# Altium schematic sheet Laser_module.schdoc: Laser Module
size 420 x 297 mm; EDA_Number: ARTIQ; Projet: KASLI 3U subsystem; CheckedBy: MK; Author: G.K.; CompanyName: CREOTECH; DrawnBy: G.K.; Organization: CTI SA; Address1: Creotech Instruments SA; Address2: Okulickiego 7/9, 05-500 Poland; DocumentNumber: 1; Revision: -; SheetNumber: 1; SheetTotal: 5; ModifiedBy: -; CreateDate: XX/XX/XXXX; CheckedDate: -; Title2: Top; DivGrp: CTI; Designer: G.K.; ModifiedDate: -; ProjectName: FMC DAC 100M 14B 16CHA ADC 2M 14B 4CHA
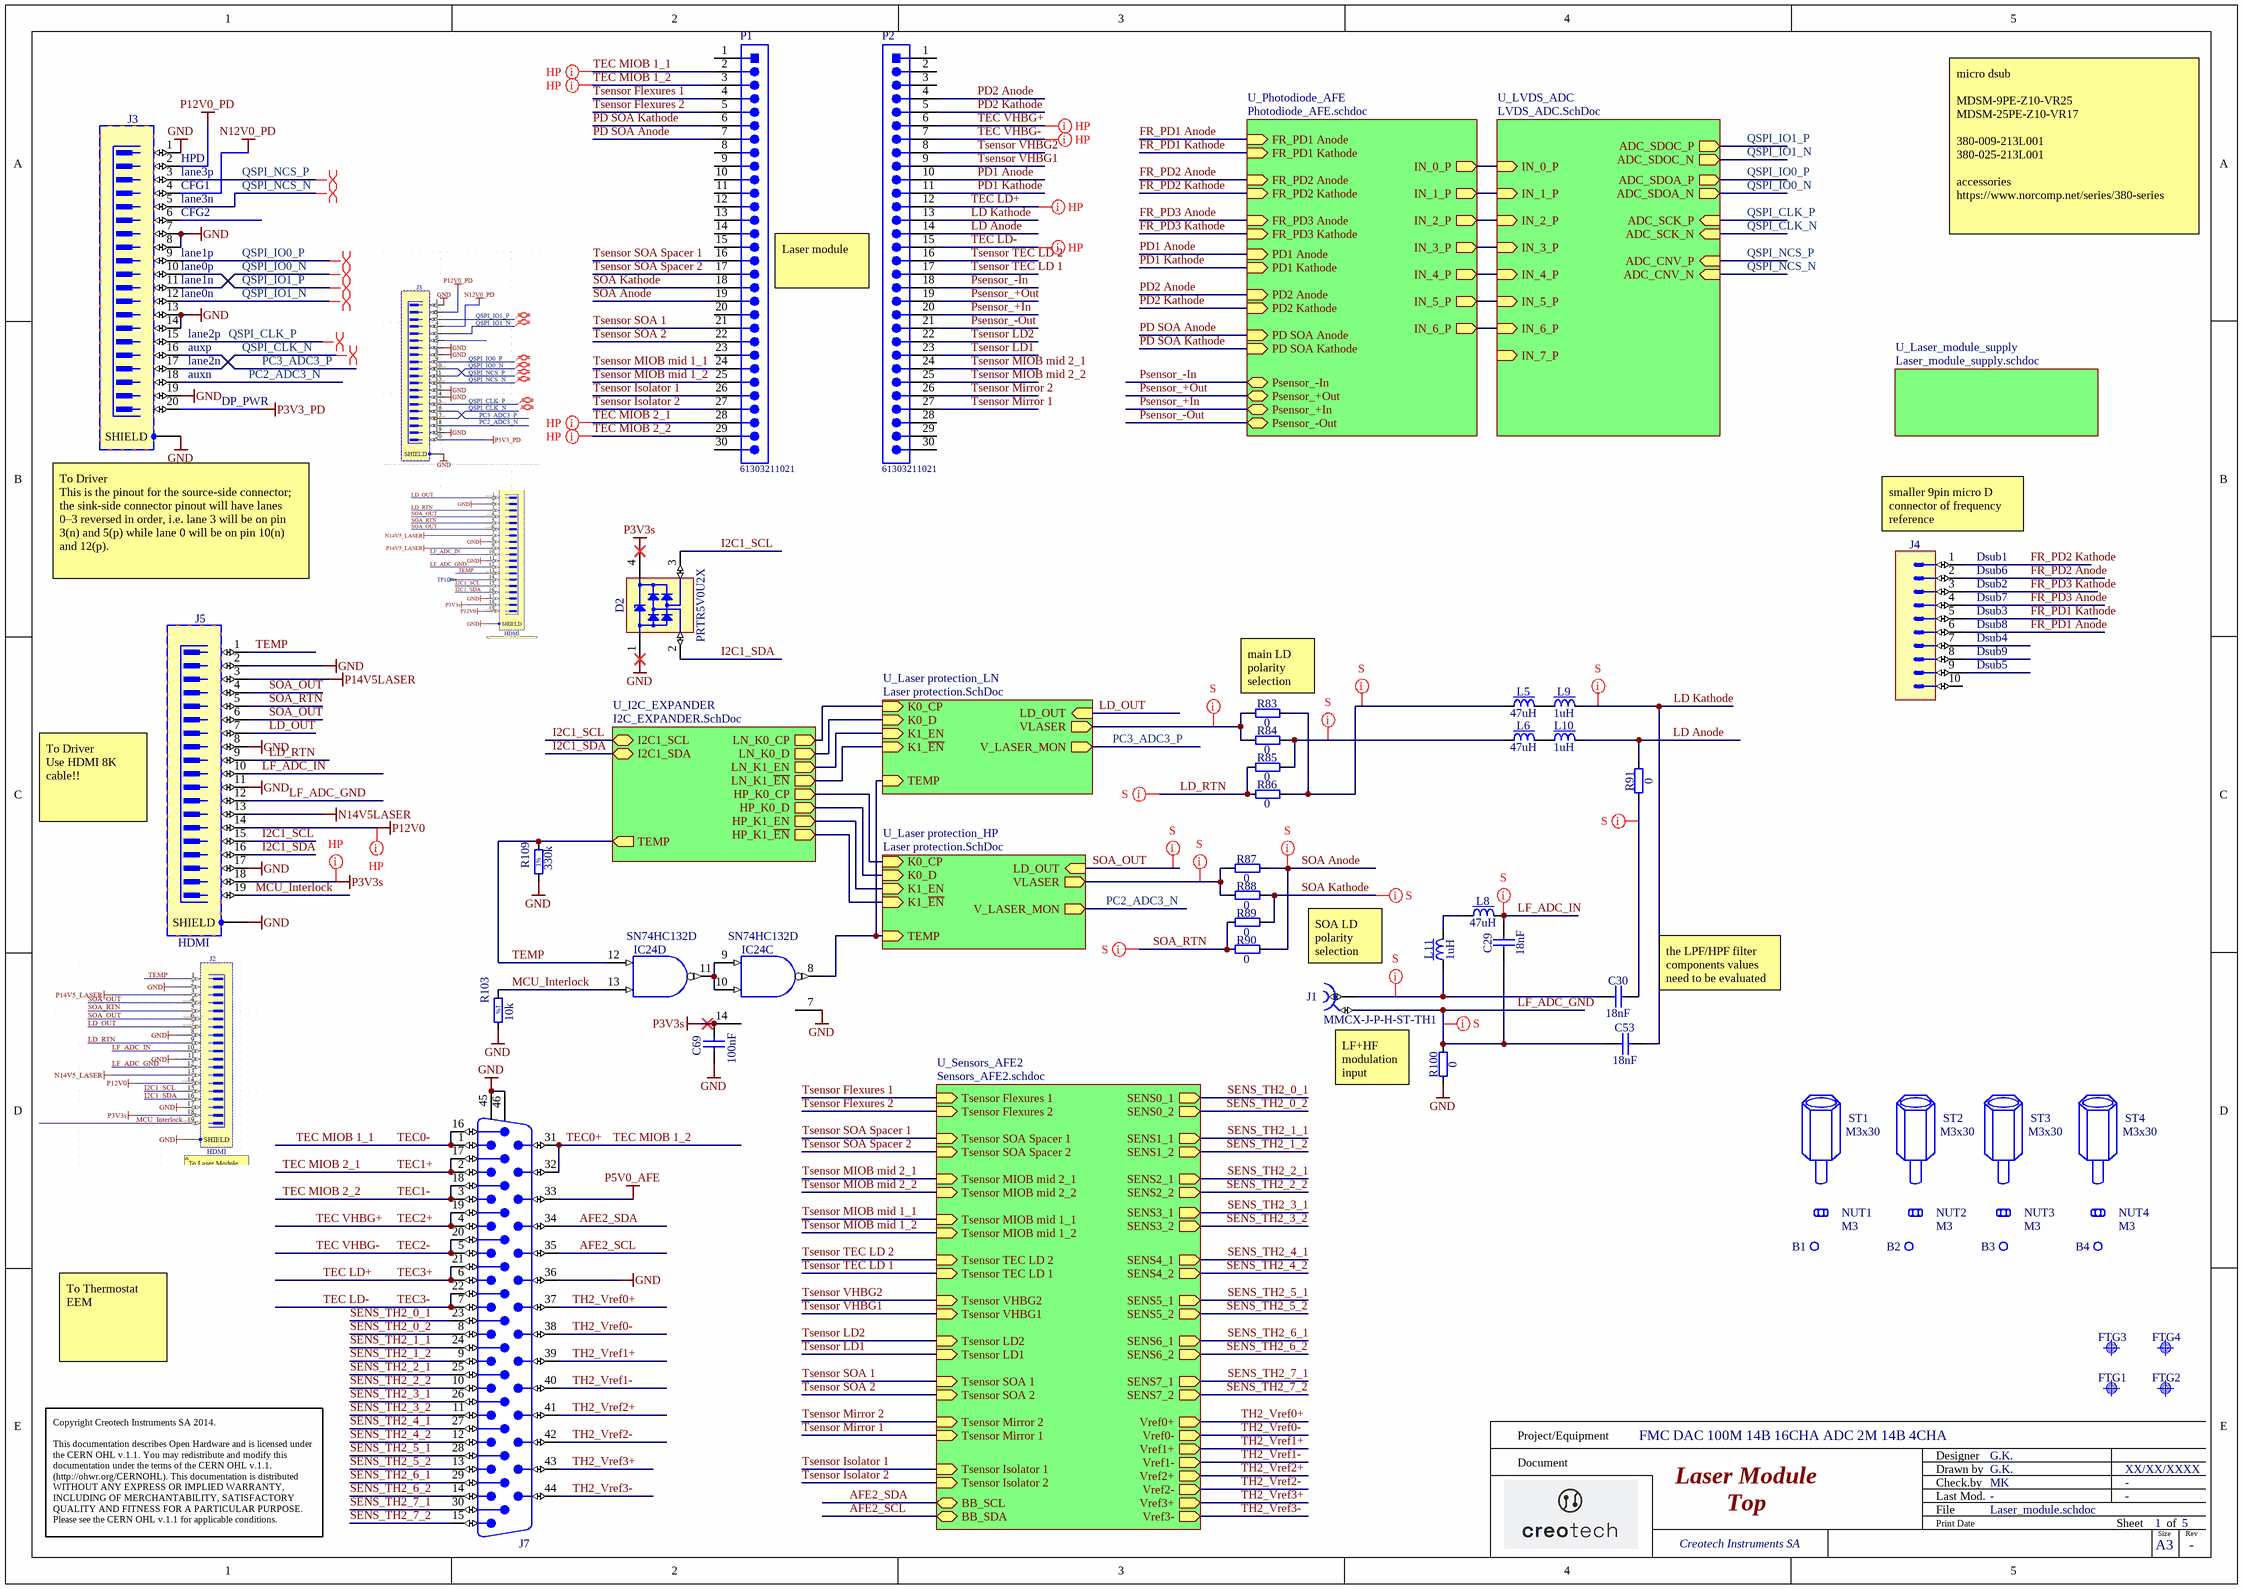
[diagram p0: Laser_module.schdoc]

## Parts
B1  Plated Hole  [MTG320_550]  (value not drawn)  (no BOM)
B2  Plated Hole  [MTG320_550]  (value not drawn)  (no BOM)
B3  Plated Hole  [MTG320_550]  (value not drawn)  (no BOM)
B4  Plated Hole  [MTG320_550]  (value not drawn)  (no BOM)
C29  18nF  [CAPC3216X140N]
C30  18nF  [CAPC3216X140N]
C53  18nF  [CAPC3216X140N]
C69  100nF  [CAPC1608X87N]
D2  PRTR5V0U2X  [SOT190P230X110-4N]
FTG1  Use only in PCB  [FIDUCIAL_TOP_C100-200]  (value not drawn)
FTG2  Use only in PCB  [FIDUCIAL_TOP_S100-200]  (value not drawn)
FTG3  Use only in PCB  [FIDUCIAL_TOP_C100-200]  (value not drawn)
FTG4  Use only in PCB  [FIDUCIAL_TOP_S100-200]  (value not drawn)
IC24  SN74HC132D  [SOIC127P600X175-14N]  (parts C,D of 4)
J1  Manufacturer Part Number: MMCX-J-P-H-ST-TH1  [SAMTEC_MMCX-J-P-H-ST-TH1]  (hidden comment: Coax_1Female_1Shield)
J3  Thunderbolt  [JAE_DP3AR020SU32JQ1R400]  (value not drawn)
J4  Header 10  [3M_N2510-6002RB]  (value not drawn)
J5  HDMI  [MOLEX_47151-0001]
J7  D-Sub  [AMPHENOL_10090926-P444XLF]  (value not drawn)
L5  47uH  [IND_MURATA-PS_8400]
L6  47uH  [IND_MURATA-PS_8400]
L8  47uH  [IND_MURATA_LQH32C]
L9  1uH  [INDC2014X145N]
L10  1uH  [INDC2014X145N]
L11  1uH  [INDC2014X145N]
NUT1  M3  [BOSSARD_BN628-1241443_v]
NUT2  M3  [BOSSARD_BN628-1241443_v]
NUT3  M3  [BOSSARD_BN628-1241443_v]
NUT4  M3  [BOSSARD_BN628-1241443_v]
P1  61303211021  [61303211021_30]
P2  61303211021  [61303211021_30]
R83  0  [RESC2012X60N]
R84  0  [RESC2012X60N]
R85  0  [RESC2012X60N]
R86  0  [RESC2012X60N]
R87  0  [RESC2012X60N]
R88  0  [RESC2012X60N]
R89  0  [RESC2012X60N]
R90  0  [RESC2012X60N]
R91  0  [RESC1005X40N]
R100  0  [RESC1005X40N]
R103  10k  [RESC1608X55N]
R109  330k  [RESC1608X55N]
ST1  M3x30  [DREMEC_TFM-M3X30/DR213]
ST2  M3x30  [DREMEC_TFM-M3X30/DR213]
ST3  M3x30  [DREMEC_TFM-M3X30/DR213]
ST4  M3x30  [DREMEC_TFM-M3X30/DR213]

## Sub-sheets
U_I2C_EXPANDER = I2C_EXPANDER.SchDoc: LN_K0_CP (out), LN_K0_D (out), LN_K1_EN (out), LN_K1_~{EN} (out), HP_K0_CP (out), HP_K0_D (out), HP_K1_EN (out), TEMP (out), I2C1_SCL (bidir), I2C1_SDA (bidir), HP_K1_~{EN} (out)
U_Laser protection_HP = Laser protection.SchDoc: LD_OUT (in), V_LASER_MON (out), K1_~{EN} (in), K1_EN (in), K0_D (in), K0_CP (in), TEMP (in), VLASER (out)
U_Laser protection_LN = Laser protection.SchDoc: LD_OUT (in), V_LASER_MON (out), K1_~{EN} (in), K1_EN (in), K0_D (in), K0_CP (in), TEMP (in), VLASER (out)
U_Laser_module_supply = Laser_module_supply.schdoc: no entries
U_LVDS_ADC = LVDS_ADC.SchDoc: IN_7_P (in), IN_6_P (in), IN_2_P (in), IN_4_P (in), IN_1_P (in), IN_3_P (in), IN_0_P (in), IN_5_P (in), ADC_CNV_N (in), ADC_SCK_P (in), ADC_SDOA_N (out), ADC_SDOC_P (out), ADC_SDOC_N (out), ADC_SDOA_P (out), ADC_SCK_N (in), ADC_CNV_P (in)
U_Photodiode_AFE = Photodiode_AFE.schdoc: FR_PD1 Anode (in), FR_PD1 Kathode (in), FR_PD2 Anode (in), FR_PD2 Kathode (in), FR_PD3 Anode (in), FR_PD3 Kathode (in), PD1 Anode (in), PD1 Kathode (in), PD2 Anode (in), PD2 Kathode (in), PD SOA Anode (in), PD SOA Kathode (in), Psensor_-In (bidir), Psensor_+Out (bidir), Psensor_+In (bidir), Psensor_-Out (bidir), IN_0_P (out), IN_1_P (out), IN_2_P (out), IN_3_P (out), IN_4_P (out), IN_5_P (out), IN_6_P (out)
U_Sensors_AFE2 = Sensors_AFE2.schdoc: SENS0_1 (out), SENS0_2 (out), SENS1_1 (out), SENS1_2 (out), SENS2_1 (out), SENS2_2 (out), SENS3_1 (out), SENS3_2 (out), SENS4_1 (out), SENS4_2 (out), SENS5_1 (out), SENS5_2 (out), SENS6_1 (out), SENS6_2 (out), SENS7_1 (out), SENS7_2 (out), Vref0+ (out), Vref0- (out), Vref1+ (out), Vref1- (out), Vref2+ (out), Vref2- (out), Vref3+ (out), Vref3- (out), BB_SCL (bidir), BB_SDA (bidir), Tsensor MIOB mid 2_1 (in), Tsensor MIOB mid 2_2 (in), Tsensor TEC LD 2 (in), Tsensor TEC LD 1 (in), Tsensor LD2 (in), Tsensor LD1 (in), Tsensor SOA 1 (in), Tsensor SOA 2 (in), Tsensor Mirror 2 (in), Tsensor Flexures 1 (in), Tsensor Flexures 2 (in), Tsensor SOA Spacer 1 (in), Tsensor SOA Spacer 2 (in), Tsensor MIOB mid 1_1 (in), Tsensor VHBG2 (in), Tsensor MIOB mid 1_2 (in), Tsensor VHBG1 (in), Tsensor Mirror 1 (in), Tsensor Isolator 1 (in), Tsensor Isolator 2 (in)

## Nets
GND: C69.1 D2.1(GND) IC24.7(GND) J3.1 J3.7 J3.8 J3.13 J3.14 J3.19 J3.SHIELD J5.2 J5.8 J5.11 J5.17 J5.SHIELD J7.36 J7.45 J7.46 R100.1 R103.2 R109.1
N12V0_PD: J3.4
N14V5LASER: J5.13
P3V3_PD: J3.20
P3V3s: C69.2 D2.4(VCC) IC24.14(VCC) J5.18  [also labelled VCC]
P5V0_AFE: J7.33
P12V0: J5.14
P12V0_PD: J3.2
P14V5LASER: J5.3
AFE2_SCL: J7.35 ; sheet U_Sensors_AFE2/BB_SDA
AFE2_SDA: J7.34 ; sheet U_Sensors_AFE2/BB_SCL
FR_PD1 Anode: J4.6 ; sheet U_Photodiode_AFE/FR_PD1 Anode
FR_PD1 Kathode: J4.5 ; sheet U_Photodiode_AFE/FR_PD1 Kathode
FR_PD2 Anode: J4.2 ; sheet U_Photodiode_AFE/FR_PD2 Anode
FR_PD2 Kathode: J4.1 ; sheet U_Photodiode_AFE/FR_PD2 Kathode
FR_PD3 Anode: J4.4 ; sheet U_Photodiode_AFE/FR_PD3 Anode
FR_PD3 Kathode: J4.3 ; sheet U_Photodiode_AFE/FR_PD3 Kathode
I2C1_SCL: D2.3(I/O2) J5.15 ; sheet U_I2C_EXPANDER/I2C1_SCL
I2C1_SDA: D2.2(I/O1) J5.16 ; sheet U_I2C_EXPANDER/I2C1_SDA
LD Anode: L10.2 P2.14 R91.2
LD Kathode: C53.2 L9.2 P2.13
LD_OUT: J5.7 ; sheet U_Laser protection_LN/LD_OUT
LD_RTN: J5.9 R85.1 R86.1
LF_ADC_GND: C29.1 C53.1 J1.2 J5.12 R100.2
LF_ADC_IN: C29.2 J5.10 L8.2
MCU_Interlock: IC24.13(B) J5.19 R103.1
PC2_ADC3_N: J3.18 ; sheet U_Laser protection_HP/V_LASER_MON
PC3_ADC3_P: J3.16 ; sheet U_Laser protection_LN/V_LASER_MON
PD1 Anode: P2.10 ; sheet U_Photodiode_AFE/PD1 Anode
PD1 Kathode: P2.11 ; sheet U_Photodiode_AFE/PD1 Kathode
PD2 Anode: P2.4 ; sheet U_Photodiode_AFE/PD2 Anode
PD2 Kathode: P2.5 ; sheet U_Photodiode_AFE/PD2 Kathode
PD SOA Anode: P1.7 ; sheet U_Photodiode_AFE/PD SOA Anode
PD SOA Kathode: P1.6 ; sheet U_Photodiode_AFE/PD SOA Kathode
Psensor_+In: P2.20 ; sheet U_Photodiode_AFE/Psensor_+In
Psensor_+Out: P2.19 ; sheet U_Photodiode_AFE/Psensor_+Out
Psensor_-In: P2.18 ; sheet U_Photodiode_AFE/Psensor_-In
Psensor_-Out: P2.21 ; sheet U_Photodiode_AFE/Psensor_-Out
QSPI_CLK_N: J3.17 ; sheet U_LVDS_ADC/ADC_SCK_N
QSPI_CLK_P: J3.15 ; sheet U_LVDS_ADC/ADC_SCK_P
QSPI_IO0_N: J3.11 ; sheet U_LVDS_ADC/ADC_SDOA_N
QSPI_IO0_P: J3.9 ; sheet U_LVDS_ADC/ADC_SDOA_P
QSPI_IO1_N: J3.12 ; sheet U_LVDS_ADC/ADC_SDOC_N
QSPI_IO1_P: J3.10 ; sheet U_LVDS_ADC/ADC_SDOC_P
QSPI_NCS_N: J3.5 ; sheet U_LVDS_ADC/ADC_CNV_N
QSPI_NCS_P: J3.3 ; sheet U_LVDS_ADC/ADC_CNV_P
SENS_TH2_0_1: J7.23 ; sheet U_Sensors_AFE2/SENS0_1
SENS_TH2_0_2: J7.8 ; sheet U_Sensors_AFE2/SENS0_2
SENS_TH2_1_1: J7.24 ; sheet U_Sensors_AFE2/SENS1_1
SENS_TH2_1_2: J7.9 ; sheet U_Sensors_AFE2/SENS1_2
SENS_TH2_2_1: J7.25 ; sheet U_Sensors_AFE2/SENS2_1
SENS_TH2_2_2: J7.10 ; sheet U_Sensors_AFE2/SENS2_2
SENS_TH2_3_1: J7.26 ; sheet U_Sensors_AFE2/SENS3_1
SENS_TH2_3_2: J7.11 ; sheet U_Sensors_AFE2/SENS3_2
SENS_TH2_4_1: J7.27 ; sheet U_Sensors_AFE2/SENS4_1
SENS_TH2_4_2: J7.12 ; sheet U_Sensors_AFE2/SENS4_2
SENS_TH2_5_1: J7.28 ; sheet U_Sensors_AFE2/SENS5_1
SENS_TH2_5_2: J7.13 ; sheet U_Sensors_AFE2/SENS5_2
SENS_TH2_6_1: J7.29 ; sheet U_Sensors_AFE2/SENS6_1
SENS_TH2_6_2: J7.14 ; sheet U_Sensors_AFE2/SENS6_2
SENS_TH2_7_1: J7.30 ; sheet U_Sensors_AFE2/SENS7_1
SENS_TH2_7_2: J7.15 ; sheet U_Sensors_AFE2/SENS7_2
SOA Anode: P1.19 R87.2 R90.2
SOA Kathode: P1.18 R88.2 R89.2
SOA_OUT: J5.4 J5.6 ; sheet U_Laser protection_HP/LD_OUT
SOA_RTN: J5.5 R89.1 R90.1
TEC LD+: J7.6 J7.21 P2.12  [also labelled TEC3+]
TEC LD-: J7.7 J7.22 P2.15  [also labelled TEC3-]
TEC MIOB 1_1: J7.1 J7.16 P1.2  [also labelled TEC0-]
TEC MIOB 1_2: J7.31 J7.32 P1.3  [also labelled TEC0+]
TEC MIOB 2_1: J7.2 J7.17 P1.28  [also labelled TEC1+]
TEC MIOB 2_2: J7.3 J7.18 P1.29  [also labelled TEC1-]
TEC VHBG+: J7.4 J7.19 P2.6  [also labelled TEC2+]
TEC VHBG-: J7.5 J7.20 P2.7  [also labelled TEC2-]
TEMP: IC24.12(A) J5.1 R109.2 ; sheet U_I2C_EXPANDER/TEMP
TH2_Vref0+: J7.37 ; sheet U_Sensors_AFE2/Vref0+
TH2_Vref0-: J7.38 ; sheet U_Sensors_AFE2/Vref0-
TH2_Vref1+: J7.39 ; sheet U_Sensors_AFE2/Vref1+
TH2_Vref1-: J7.40 ; sheet U_Sensors_AFE2/Vref1-
TH2_Vref2+: J7.41 ; sheet U_Sensors_AFE2/Vref2+
TH2_Vref2-: J7.42 ; sheet U_Sensors_AFE2/Vref2-
TH2_Vref3+: J7.43 ; sheet U_Sensors_AFE2/Vref3+
TH2_Vref3-: J7.44 ; sheet U_Sensors_AFE2/Vref3-
Tsensor Flexures 1: P1.4 ; sheet U_Sensors_AFE2/Tsensor Flexures 1
Tsensor Flexures 2: P1.5 ; sheet U_Sensors_AFE2/Tsensor Flexures 2
Tsensor Isolator 1: P1.26 ; sheet U_Sensors_AFE2/Tsensor Isolator 1
Tsensor Isolator 2: P1.27 ; sheet U_Sensors_AFE2/Tsensor Isolator 2
Tsensor LD1: P2.23 ; sheet U_Sensors_AFE2/Tsensor LD1
Tsensor LD2: P2.22 ; sheet U_Sensors_AFE2/Tsensor LD2
Tsensor MIOB mid 1_1: P1.24 ; sheet U_Sensors_AFE2/Tsensor MIOB mid 1_1
Tsensor MIOB mid 1_2: P1.25 ; sheet U_Sensors_AFE2/Tsensor MIOB mid 1_2
Tsensor MIOB mid 2_1: P2.24 ; sheet U_Sensors_AFE2/Tsensor MIOB mid 2_1
Tsensor MIOB mid 2_2: P2.25 ; sheet U_Sensors_AFE2/Tsensor MIOB mid 2_2
Tsensor Mirror 1: P2.27 ; sheet U_Sensors_AFE2/Tsensor Mirror 1
Tsensor Mirror 2: P2.26 ; sheet U_Sensors_AFE2/Tsensor Mirror 2
Tsensor SOA 1: P1.21 ; sheet U_Sensors_AFE2/Tsensor SOA 1
Tsensor SOA 2: P1.22 ; sheet U_Sensors_AFE2/Tsensor SOA 2
Tsensor SOA Spacer 1: P1.16 ; sheet U_Sensors_AFE2/Tsensor SOA Spacer 1
Tsensor SOA Spacer 2: P1.17 ; sheet U_Sensors_AFE2/Tsensor SOA Spacer 2
Tsensor TEC LD 1: P2.17 ; sheet U_Sensors_AFE2/Tsensor TEC LD 1
Tsensor TEC LD 2: P2.16 ; sheet U_Sensors_AFE2/Tsensor TEC LD 2
Tsensor VHBG1: P2.9 ; sheet U_Sensors_AFE2/Tsensor VHBG1
Tsensor VHBG2: P2.8 ; sheet U_Sensors_AFE2/Tsensor VHBG2
NetC30_1: C30.1 J1.1 L11.1
NetC30_2: C30.2 R91.1
NetIC24_8: IC24.8(~{O}) ; sheet U_Laser protection_LN/TEMP, sheet U_Laser protection_HP/TEMP
NetIC24_9: IC24.9(A) IC24.10(B) IC24.11(~{O})
NetL5_1: L5.1 R83.2 R86.2
NetL5_2: L5.2 L9.1
NetL6_1: L6.1 R84.2 R85.2
NetL6_2: L6.2 L10.1
NetL8_1: L8.1 L11.2
NetR83_1: R83.1 R84.1 ; sheet U_Laser protection_LN/VLASER
NetR87_1: R87.1 R88.1 ; sheet U_Laser protection_HP/VLASER
(unnamed): sheet U_Photodiode_AFE/IN_0_P, sheet U_LVDS_ADC/IN_0_P
(unnamed): sheet U_Photodiode_AFE/IN_1_P, sheet U_LVDS_ADC/IN_1_P
(unnamed): sheet U_Photodiode_AFE/IN_2_P, sheet U_LVDS_ADC/IN_2_P
(unnamed): sheet U_Photodiode_AFE/IN_3_P, sheet U_LVDS_ADC/IN_3_P
(unnamed): sheet U_Photodiode_AFE/IN_4_P, sheet U_LVDS_ADC/IN_4_P
(unnamed): sheet U_Photodiode_AFE/IN_5_P, sheet U_LVDS_ADC/IN_5_P
(unnamed): sheet U_Photodiode_AFE/IN_6_P, sheet U_LVDS_ADC/IN_6_P
(unnamed): sheet U_I2C_EXPANDER/LN_K0_CP, sheet U_Laser protection_LN/K0_CP
(unnamed): sheet U_I2C_EXPANDER/LN_K0_D, sheet U_Laser protection_LN/K0_D
(unnamed): sheet U_I2C_EXPANDER/LN_K1_EN, sheet U_Laser protection_LN/K1_EN
(unnamed): sheet U_I2C_EXPANDER/LN_K1_~{EN}, sheet U_Laser protection_LN/K1_~{EN}
(unnamed): sheet U_I2C_EXPANDER/HP_K0_CP, sheet U_Laser protection_HP/K0_CP
(unnamed): sheet U_I2C_EXPANDER/HP_K0_D, sheet U_Laser protection_HP/K0_D
(unnamed): sheet U_I2C_EXPANDER/HP_K1_EN, sheet U_Laser protection_HP/K1_EN
(unnamed): sheet U_I2C_EXPANDER/HP_K1_~{EN}, sheet U_Laser protection_HP/K1_~{EN}

Not connected (* = marked no-connect by the designer): B1 1; B2 1; B3 1; B4 1; J3 6; J4 7 8 9 10; P1 1 8 9 10 11 12 13 14 15 20 23 30; P2 1 2 3 28 29 30

## Layout directives
differential pair: QSPI_CLK_N, QSPI_CLK_P, QSPI_IO0_N, QSPI_IO0_P, QSPI_IO1_N, QSPI_IO1_P, QSPI_NCS_N, QSPI_NCS_P
net class HP: P3V3s, P12V0, TEC LD+, TEC LD-, TEC MIOB 1_1, TEC MIOB 1_2, TEC MIOB 2_1, TEC MIOB 2_2, TEC VHBG+, TEC VHBG-
net class Sensitive: LD Kathode, LD_RTN, LF_ADC_GND, LF_ADC_IN, NetC30_1, NetC30_2, NetL5_1, NetL6_1, NetR83_1, NetR87_1, SOA Anode, SOA Kathode, SOA_OUT, SOA_RTN

## Notes on the sheet
- (near J3) CFG1
- (near J3) HPD
- (near J3) lane3p
- (near J3) lane1p
- (near J3) CFG2
- (near J3) lane3n
- micro dsub
  MDSM-9PE-Z10-VR25
  MDSM-25PE-Z10-VR17
  380-009-213L001
  380-025-213L001
  accessories
  https://www.norcomp.net/series/380-series
- (near J3) lane1n
- (near J3) lane0p
- (near J3) lane0n
- Laser module
- (near J3) lane2p
- (near J3) lane2n
- (near J3) auxp
- (near J3) auxn
- DP_PWR
- (near J4) smaller 9pin micro D connector of frequency reference
- (near J3) To Driver
  This is the pinout for the source-side connector; the sink-side connector pinout will have lanes 0–3 reversed in order, i.e. lane 3 will be on pin 3(n) and 5(p) while lane 0 will be on pin 10(n) and 12(p).
- (near J4) Dsub1
- (near J4) Dsub2
- (near J4) Dsub6
- (near J4) Dsub3
- (near J4) Dsub4
- (near J4) Dsub5
- (near J4) Dsub7
- (near J4) Dsub8
- (near J4) Dsub9
- (near R83) main LD polarity selection
- To Driver
  Use HDMI 8K cable!!
- SOA LD polarity selection
- (near C30) the LPF/HPF filter components values need to be evaluated
- LF+HF modulation input
- To Thermostat EEM
- Project/Equipment
- Document
- Designer
- Drawn by
- Check.by
- Copyright Creotech Instruments SA 2014.
  This documentation describes Open Hardware and is licensed under the CERN OHL v.1.1. You may redistribute and modify this documentation under the terms of the CERN OHL v.1.1. (http://ohwr.org/CERNOHL). This documentation is distributed WITHOUT ANY EXPRESS OR IMPLIED WARRANTY, INCLUDING OF MERCHANTABILITY, SATISFACTORY QUALITY AND FITNESS FOR A PARTICULAR PURPOSE. Please see the CERN OHL v.1.1 for applicable conditions.
- File
- Last Mod.
- Print Date
- Sheet
- Size
- A3
- of
- Rev
- (in symbol R0603_10K_1%_0.1W_100PPM) 1%
- (in symbol R0603_330K_1%_0.1W_100PPM) 1%

## Library data of the parts
B1-B4 = PLATED_HOLE3.2_PAD5.5: Single Terminal Socket; Part Description: Plated Through Hole: Hole Dia.=3.2mm Pad Dia.=5.5mm; Mounted: No; Part Number: PLATED_HOLE3.2_PAD5.5; Component Type: Standard (No BOM); Pin Count: 1; Family: Plated Hole; Socket: No; SMD: No; Sense: No; Status: None; ComponentHeight: 0mm; HelpURL: Undefined; Author: CERN DEM JMW; CreateDate: 01.10.2012; LatestRevisionDate: 01.10.2012; PackageDescription: Plated Through Hole: Hole Dia.=3.2mm Pad Dia.=5.5mm
C29 C30 C53 = CC1206_18NF_50V_10%_X7R: Non-polarised capacitor; Part Description: SMD Multilayer Chip Ceramic Capacitor; Manufacturer: GENERIC; Manufacturer1 Part Number: 223858115639; Voltage: 50V; TC: X7R; Tolerance: ±10%; Part Number: CC1206_18NF_50V_10%_X7R; Component Kind: Standard; Component Type: Standard; Pin Count: 2; Value: 18nF; Status: Not Recommended; Manufacturer Part Number: CC1206_18NF_50V_10%_X7R; Case: 1206; Mounted: Yes; Socket: No; SMD: Yes; Sense: No; Manufacturer1 Example: PHYCOMP; Manufacturer1 ComponentHeight: 1.25mm; HelpURL: \\cern.ch\dfs\Applications\Altium\Datasheets\CC1206_X7R_PHYCOMP.pdf; Author: CERN DEM JLC; CreateDate: 03.12.2007; LatestRevisionDate: 03.12.2007
C69 = CC0603_100NF_50V_10%_X7R: Non-polarised capacitor; Part Description: SMD Multilayer Chip Ceramic Capacitor; Manufacturer: GENERIC; Manufacturer1 Part Number: 223858615649; Voltage: 50V; TC: X7R; Tolerance: ±10%; Part Number: CC0603_100NF_50V_10%_X7R; Component Kind: Standard; Component Type: Standard; Pin Count: 2; Value: 100nF; Status: Preferred; Manufacturer Part Number: CC0603_100NF_50V_10%_X7R; Case: 0603; Mounted: Yes; Socket: No; SMD: Yes; Sense: No; Manufacturer1 Example: PHYCOMP; Manufacturer1 ComponentHeight: 0.87mm; HelpURL: \\cern.ch\dfs\Applications\Altium\Datasheets\CC0603_X7R_PHYCOMP.pdf; Author: CERN DEM JLC; CreateDate: 03.12.2007; LatestRevisionDate: 03.12.2007
D2 = PRTR5V0U2X: Ultra Low Capacitance Double Rail-to-Rail ESD Protection Diode; Part Description: Ultra Low Capacitance (1pF) Double Rail-to-Rail ESD Protection Diode (8kV); Manufacturer: NXP SEMICONDUCTORS; Voltage: 5.5V; PressFit: No; Bonding: No; Part Number: PRTR5V0U2X; Component Kind: Standard; Component Type: Standard; Device: PRTR5V0U2X; PackageDescription: SOT143B, SOT, 1.90mm Pitch; 4 Pin, 1.30mm W X 2.90mm L X 1.10mm H body, IPC Medium Density; Manufacturer Part Number: PRTR5V0U2X; Pin Count: 4; Case: SOT143B; Mounted: Yes; Socket: No; SMD: Yes; Sense: No; ComponentHeight: 1.1mm; HelpURL: \\cern.ch\dfs\Applications\Altium\Datasheets\PRTR5V0U2X.pdf; Author: CERN DEM JLC; CreateDate: 22.03.2011; LatestRevisionDate: 22.03.2011
FTG1 FTG3 = FIDUCIAL_TARGET_C100-200: Fiducial Target; Part Description: Round Fiducial Target, Top Layer, 1.0mm, Top Solder 2.0mm, Keepout =2.0mm; Mounted: No; Part Number: FIDUCIAL_TARGET_C100-200; Component Kind: Standard (No BOM); Component Type: Standard (No BOM); Pin Count: 1; Family: Fiducial; Socket: No; SMD: Yes; Sense: No; Status: None; ComponentHeight: 0mm; HelpURL: Undefined; Author: CERN DEM JLC; CreateDate: 09.02.2010; LatestRevisionDate: 04.04.2012; PackageDescription: Round Fiducial Target, Top Layer, 1.0mm, Top Solder 2.0mm, Keepout =2.0mm
FTG2 FTG4 = FIDUCIAL_TARGET_S100-200: Fiducial Target; Part Description: Square Fiducial Target, Top Layer, 1.0mm, Top Solder 2.0mm, Keepout =2.0mm; Mounted: No; Part Number: FIDUCIAL_TARGET_S100-200; Component Kind: Standard (No BOM); Component Type: Standard (No BOM); Pin Count: 1; Family: Fiducial; Socket: No; SMD: Yes; Sense: No; Status: None; ComponentHeight: 0mm; HelpURL: Undefined; Author: CERN DEM JLC; CreateDate: 09.02.2010; LatestRevisionDate: 04.04.2012; PackageDescription: Square Fiducial Target, Top Layer, 1.0mm, Top Solder 2.0mm, Keepout =2.0mm
IC24 = SN74HC132D: Quad Positive NAND Gate With Schmitt-Trigger Input; Manufacturer: TEXAS INSTRUMENTS; PressFit: No; Bonding: No; Part Number: SN74HC132D; Component Kind: Standard; Component Type: Standard; Device: SN74HC132D; PackageDescription: SOIC 14, Pitch 1.27mm - Body 4x8.75mm, IPC Medium Density; Part Description: Quad Positive NAND Gate With Schmitt-Trigger Input; Manufacturer Part Number: SN74HC132D; Pin Count: 14; Case: SOIC14; Mounted: Yes; Socket: No; SMD: Yes; Sense: No; ComponentHeight: 1.75mm; Author: CERN DEM JLC; HelpURL: \\cern.ch\dfs\Applications\Altium\Datasheets\SN74HC132D.pdf; CreateDate: 21.08.2008; LatestRevisionDate: 21.08.2008
J1 = SAMTEC_MMCX-J-P-H-ST-TH1: Part Description: Straight Through-hole 50 Ohm Micro Mini RF Jack, MMCX Series; Manufacturer: SAMTEC; PressFit: No; Part Number: SAMTEC_MMCX-J-P-H-ST-TH1; Component Kind: Standard; Component Type: Standard; Pin Count: 2; Mounted: Yes; Socket: No; SMD: No; Sense: No; Status: None; ComponentHeight: 4.35mm; HelpURL: \\cern.ch\dfs\Applications\Altium\Datasheets\SAMTEC_MMCX-J-P-H-ST-TH1.pdf; Author: CERN DEM JLC; CreateDate: 05.12.2012; LatestRevisionDate: 05.12.2012
J3 = JAE_DP3AR020SU32JQ1R400: Connector Mini DisplayPort 20 Male + 1 Shield; Part Description: 20 Positions, 0.6mm Pitch, ThunderboltTM Technology Compatible Right Angled Connector; Manufacturer: JAE (JAPAN AVIATION ELECTRONICS INDUSTRY); PressFit: No; Part Number: JAE_DP3AR020SU32JQ1R400; Component Kind: Standard; Component Type: Standard; Pin Count: 21; Family: Thunderbolt; Mounted: Yes; Socket: No; SMD: Yes; Sense: No; Status: None; Manufacturer Part Number: DP3AR020SU32JQ1R400; ComponentHeight: 6.1mm; HelpURL: \\cern.ch\dfs\Applications\Altium\Datasheets\JAE_DP3AR020SU32JQ1R400.pdf; ComponentLink1URL: \\cern.ch\dfs\Applications\Altium\Datasheets\JAE_DP3_Catalog.pdf; ComponentLink1Description: DP3 Series Catalog; Author: CERN DEM JLC; CreateDate: 25.02.2015; LatestRevisionDate: 25.02.2015
J4 = 3M_N2510-6002RB: Connector 10 Male; Part Description: 10 Contacts, Straight .100'' x .100'' Low Profile Four-Wall Header, 2500 Series; Manufacturer: 3M; PressFit: No; Part Number: 3M_N2510-6002RB; Component Kind: Standard; Component Type: Standard; Pin Count: 10; Family: Header 10; Mounted: Yes; Socket: No; SMD: No; Sense: No; Status: None; Manufacturer Part Number: N2510-6002RB; ComponentHeight: 10.03mm; HelpURL: \\cern.ch\dfs\Applications\Altium\Datasheets\3M_N2510-6002RB.pdf; Author: CERN DEM JLC; CreateDate: 11.02.2009; LatestRevisionDate: 11.08.2009
J5 = MOLEX_47151-0001: Connector HDMI 19 Male + 1 Shield; Part Description: 0.5mm Pitch, Surface Mount Right Angle 19 Contacts HDMI Receptacle With Thru Hole Mounting Pads; Manufacturer: MOLEX; PressFit: No; Part Number: MOLEX_47151-0001; Component Kind: Standard; Component Type: Standard; Pin Count: 20; Family: HDMI; Mounted: Yes; Socket: No; SMD: Yes; Sense: No; Status: None; Manufacturer Part Number: 47151-0001; ComponentHeight: 6.18mm; HelpURL: \\cern.ch\dfs\Applications\Altium\Datasheets\MOLEX_47151-0001.pdf; Author: CERN DEM JLC; CreateDate: 23.02.2015; LatestRevisionDate: 23.02.2015
J7 = AMPHENOL_10090926-P444XLF: Connector D-sub 44 Male; Part Description: Right Angle High Density D-sub 44 Male Contacts with Harpoons + UNC 4-40 Clinchnuts + Electrical Continuity; PressFit: No; Part Number: AMPHENOL_10090926-P444XLF; Component Kind: Standard; Component Type: Standard; Pin Count: 46; Family: D-Sub; Mounted: Yes; Socket: No; SMD: No; Sense: No; Status: None; Manufacturer: AMPHENOL; Manufacturer Part Number: 10090926-P444XLF; ComponentHeight: 12.8mm; HelpURL: \\cern.ch\dfs\Applications\Altium\Datasheets\AMPHENOL_10090926-P444XLF.pdf; Author: CERN DEM BC; CreateDate: 22.10.2020; LatestRevisionDate: 22.10.2020
L5 L6 = IND_47UH_10%_MURATA-PS_8400: Inductor With Core; Part Description: Miniature Surface Mount Power Inductor (8400 Series); Manufacturer: MURATA POWER SOLUTIONS; Manufacturer Part Number: 84473C; Power: 420mA; Resistance: 1.1R; Tolerance: ±10%; Part Number: IND_47UH_10%_MURATA-PS_8400; Component Kind: Standard; Component Type: Standard; Pin Count: 2; Value: 47uH; Mounted: Yes; Socket: No; SMD: Yes; Sense: No; ComponentHeight: 2.9mm; HelpURL: \\cern.ch\dfs\Applications\Altium\Datasheets\IND_MURATA-PS_8400.pdf; Author: CERN DEM JLC; CreateDate: 21.09.2011; LatestRevisionDate: 21.09.2011
L8 = IND_47UH_10%_MURATA_LQH32CN470K23L: Inductor With Core; Part Description: Chip Inductor (Chip Coil) for Choke Wire Wound Type; Manufacturer: MURATA; Power: 170mA; Resistance: 1.3R; Tolerance: ±10%; Part Number: IND_47UH_10%_MURATA_LQH32CN470K23L; Component Kind: Standard; Component Type: Standard; Pin Count: 2; Value: 47uH; Manufacturer Part Number: LQH32CN470K23; Mounted: Yes; Socket: No; SMD: Yes; Sense: No; ComponentHeight: 2.2mm; HelpURL: \\cern.ch\dfs\Applications\Altium\Datasheets\IND_MURATA_LQH32CN_23.pdf; Author: CERN DEM JLC; CreateDate: 20.01.2009; LatestRevisionDate: 04.07.2018
L9-L11 = IND0805_1UH_5%_EPCOS_B82498B: Inductor With Core; Part Description: SMT Inductor SIMID Series; Manufacturer: EPCOS; Manufacturer Part Number: B82498B1102J; Power: 250mA; Resistance: 0.50R; Tolerance: ±5%; Part Number: IND0805_1UH_5%_EPCOS_B82498B; Component Kind: Standard; Component Type: Standard; Pin Count: 2; Value: 1uH; Status: Preferred; Case: 0805; Mounted: Yes; Socket: No; SMD: Yes; Sense: No; ComponentHeight: 1.45mm; HelpURL: \\cern.ch\dfs\Applications\Altium\Datasheets\IND0805_EPCOS_B82498B.pdf; Author: CERN DEM JLC; CreateDate: 11.02.2008; LatestRevisionDate: 26.06.2008
NUT1-NUT4 = BOSSARD_BN628-1241443_v: Nut; Part Description: M3 Hexagon Nut ~0,8d, ISO 4032, DIN 934, Stainless Steel A2; Manufacturer Part Number: BN628 Art.1241443; PressFit: No; Part Number: BOSSARD_BN628-1241443_v; Component Kind: Standard; Component Type: Mechanical; Pin Count: 0; PackageDescription: M3 Hexagon Nut ~0,8d, ISO 4032, DIN 934, Stainless Steel A2; Mounted: Yes; Socket: No; SMD: No; Sense: No; Status: None; Value: M3; Manufacturer: BOSSARD; ComponentHeight: 2.4mm; HelpURL: \\cern.ch\dfs\Applications\Altium\Datasheets\BOSSARD_BN628-1241443.pdf; Author: CERN DEM JMW; CreateDate: 04.12.2015; LatestRevisionDate: 04.12.2015
P1 P2 = Con_1x30_2.54_61303211021: WR-PHD Pin Header, THT, pitch 2.54mm, Single Row, Angled, 32p; Manufacturer: Wurth Elektronik; Pin Number: 32; Rated Current: 3A; Working Voltage: 250VAC; Withstanding Voltage: 500VAC; Contact Resistance: 20mOhm; ComponentLink1Description: Manufacturer; ComponentLink1URL: http://www.we-online.de; ComponentLink2Description: Datasheet; ComponentLink2URL: https://www.we-online.com/catalog/datasheet/61303211021.pdf; Manufacturer Part Number: 61303211021; Pitch: 2.54mm; Operating Temperature: -40 to +105degC; Mounting Technology: THT; Packaging: Bag; Gender: Pin Header; Row Number: Single; Orientation: Angled
R83-R90 = R0805_0R_JUMPER: Resistor; Part Description: 2A (0.05R Max DC Resistance) Zero Ohm Jumper; Manufacturer: GENERIC; Manufacturer1 Part Number: NRC10Z0; PressFit: No; Part Number: R0805_0R_JUMPER; Component Kind: Standard; Component Type: Standard; Pin Count: 2; Value: 0; Status: Preferred; Manufacturer Part Number: R0805_0R_JUMPER; Case: 0805; Mounted: Yes; Sense: No; Socket: No; SMD: Yes; Manufacturer1 Example: NIC COMPONENT; Manufacturer1 ComponentHeight: 0.6mm; HelpURL: \\cern.ch\dfs\Applications\Altium\Datasheets\R0805_NIC_NRC.pdf; Author: CERN DEM JLC; CreateDate: 03.12.2007; LatestRevisionDate: 13.03.2008
R91 R100 = R0402_0R_JUMPER: Resistor; Part Description: 1A (0.05R Max DC Resistance) Zero Ohm Jumper; Manufacturer: GENERIC; Manufacturer1 Part Number: 232270591001L; PressFit: No; Part Number: R0402_0R_JUMPER; Component Kind: Standard; Component Type: Standard; Pin Count: 2; Value: 0; Status: Not Recommended; Manufacturer Part Number: R0402_0R_JUMPER; Case: 0402; Mounted: Yes; Sense: No; Socket: No; SMD: Yes; Manufacturer1 Example: YAGEO PHYCOMP; Manufacturer1 ComponentHeight: 0.4mm; HelpURL: \\cern.ch\dfs\Applications\Altium\Datasheets\R0402_Phycomp_RC0402.pdf; Author: CERN DEM JLC; CreateDate: 03.12.2007; LatestRevisionDate: 17.10.2012
R103 = R0603_10K_1%_0.1W_100PPM: Resistor - 1%; Part Description: General Purpose Thick Film Chip Resistor; Manufacturer: GENERIC; Manufacturer1 Part Number: NRC06F1002TRF; Power: 0.1W; TC: ±100ppm/°C; PressFit: No; Part Number: R0603_10K_1%_0.1W_100PPM; Component Kind: Standard; Component Type: Standard; Pin Count: 2; Value: 10k; Status: Preferred; Tolerance: ±1%; Manufacturer Part Number: R0603_10K_1%_0.1W_100PPM; Case: 0603; Mounted: Yes; Sense: No; Socket: No; SMD: Yes; Manufacturer1 Example: NIC COMPONENT; Manufacturer1 ComponentHeight: 0.55mm; HelpURL: \\cern.ch\dfs\Applications\Altium\Datasheets\R0603_NIC_NRC.pdf; Author: CERN DEM JLC; CreateDate: 03.12.2007; LatestRevisionDate: 13.03.2008
R109 = R0603_330K_1%_0.1W_100PPM: Resistor - 1%; Part Description: General Purpose Thick Film Chip Resistor; Manufacturer: GENERIC; Manufacturer1 Part Number: NRC06F3303TRF; Power: 0.1W; TC: ±100ppm/°C; PressFit: No; Part Number: R0603_330K_1%_0.1W_100PPM; Component Kind: Standard; Component Type: Standard; Pin Count: 2; Value: 330k; Status: Preferred; Tolerance: ±1%; Manufacturer Part Number: R0603_330K_1%_0.1W_100PPM; Case: 0603; Mounted: Yes; Sense: No; Socket: No; SMD: Yes; Manufacturer1 Example: NIC COMPONENT; Manufacturer1 ComponentHeight: 0.55mm; HelpURL: \\cern.ch\dfs\Applications\Altium\Datasheets\R0603_NIC_NRC.pdf; Author: CERN DEM JLC; CreateDate: 03.12.2007; LatestRevisionDate: 13.03.2008
ST1-ST4 = MECH_Standoff_M3x30: M3x30 standoff; Part Number: DREMEC_DREMEC_TFM-M3X30/DR213; Part Description: M3x30 male - female Hex Spacer made of free-machining brass with nickel plated finish; Manufacturer: DREMEC; Manufacturer Part Number: TFM-M3X30/DR213; PressFit: No; Component Kind: Standard; Component Type: Mechanical; Footprint: DREMEC_DREMEC_TFM-M3X30/DR213; Pin Count: 0; PackageDescription: M3 L=30mm   Fully Threaded - Stainless Steel spacer; Mounted: Yes; Socket: No; SMD: No; Sense: No; Status: None; Value: M3x30; ComponentHeight: 30mm; HelpURL: \\cern.ch\dfs\Applications\Altium\Datasheets\BOSSARD_BN5687-3061597.pdf; Author: GK; CreateDate: 25.02.2019; LatestRevisionDate: 25.02.2019